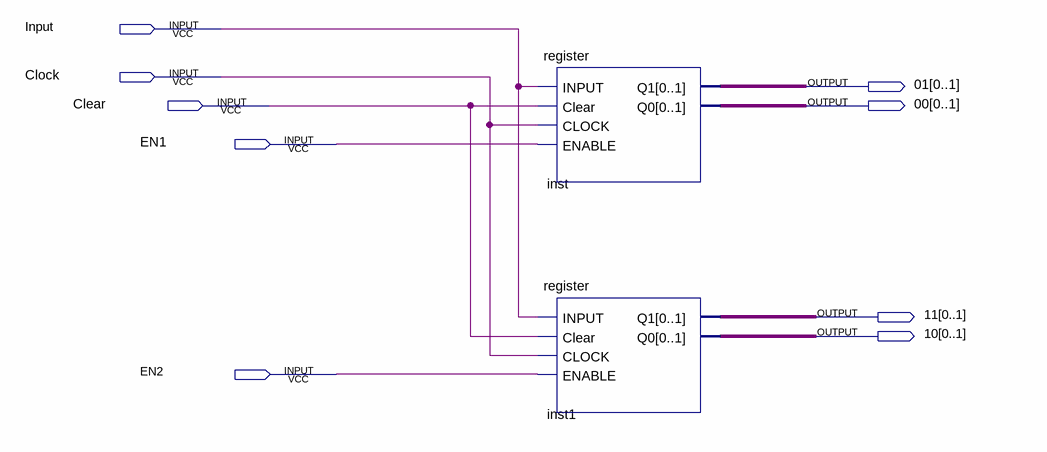
[diagram p0: schematic sheet]
// Quartus schematic stepA.bdf as structural Verilog: 2 symbols, 9 pins
module stepA (
  input  Input,
  input  Clock,
  input  Clear,
  input  EN1,
  input  EN2,
  output [0:1] \01 ,
  output [0:1] \00 ,
  output [0:1] \11 ,
  output [0:1] \10 
);

  register inst (.INPUT(Input), .Clear(Clear), .CLOCK(Clock), .ENABLE(EN1), .Q1(\01 ), .Q0(\00 ));
  register inst1 (.INPUT(Input), .Clear(Clear), .CLOCK(Clock), .ENABLE(EN2), .Q1(\11 ), .Q0(\10 ));
endmodule
